# Altium schematic sheet MCU_144_IOs.SchDoc: MCU 144 I/Os
size Tabloid; Date: Not used; ApprovedBy: Not used; CheckedBy: Not used; Author: Not used; CompanyName: STMicroelectronics; DrawnBy: Not used; Engineer: Not used; Organization: Not used; Address1: Not used; Address2: Not used; Address3: Not used; Address4: Not used; DocumentNumber: 3; Revision: Not used; SheetNumber: 3; SheetTotal: 9; CurrentTime: Not used; CurrentDate: Not used; Time: Not used; DocumentFullPathAndName: Not used; DocumentName: Not used; ModifiedDate: Not used; ImagePath: Not used; ProjectName: Not used; Application_BuildNumber: Not used
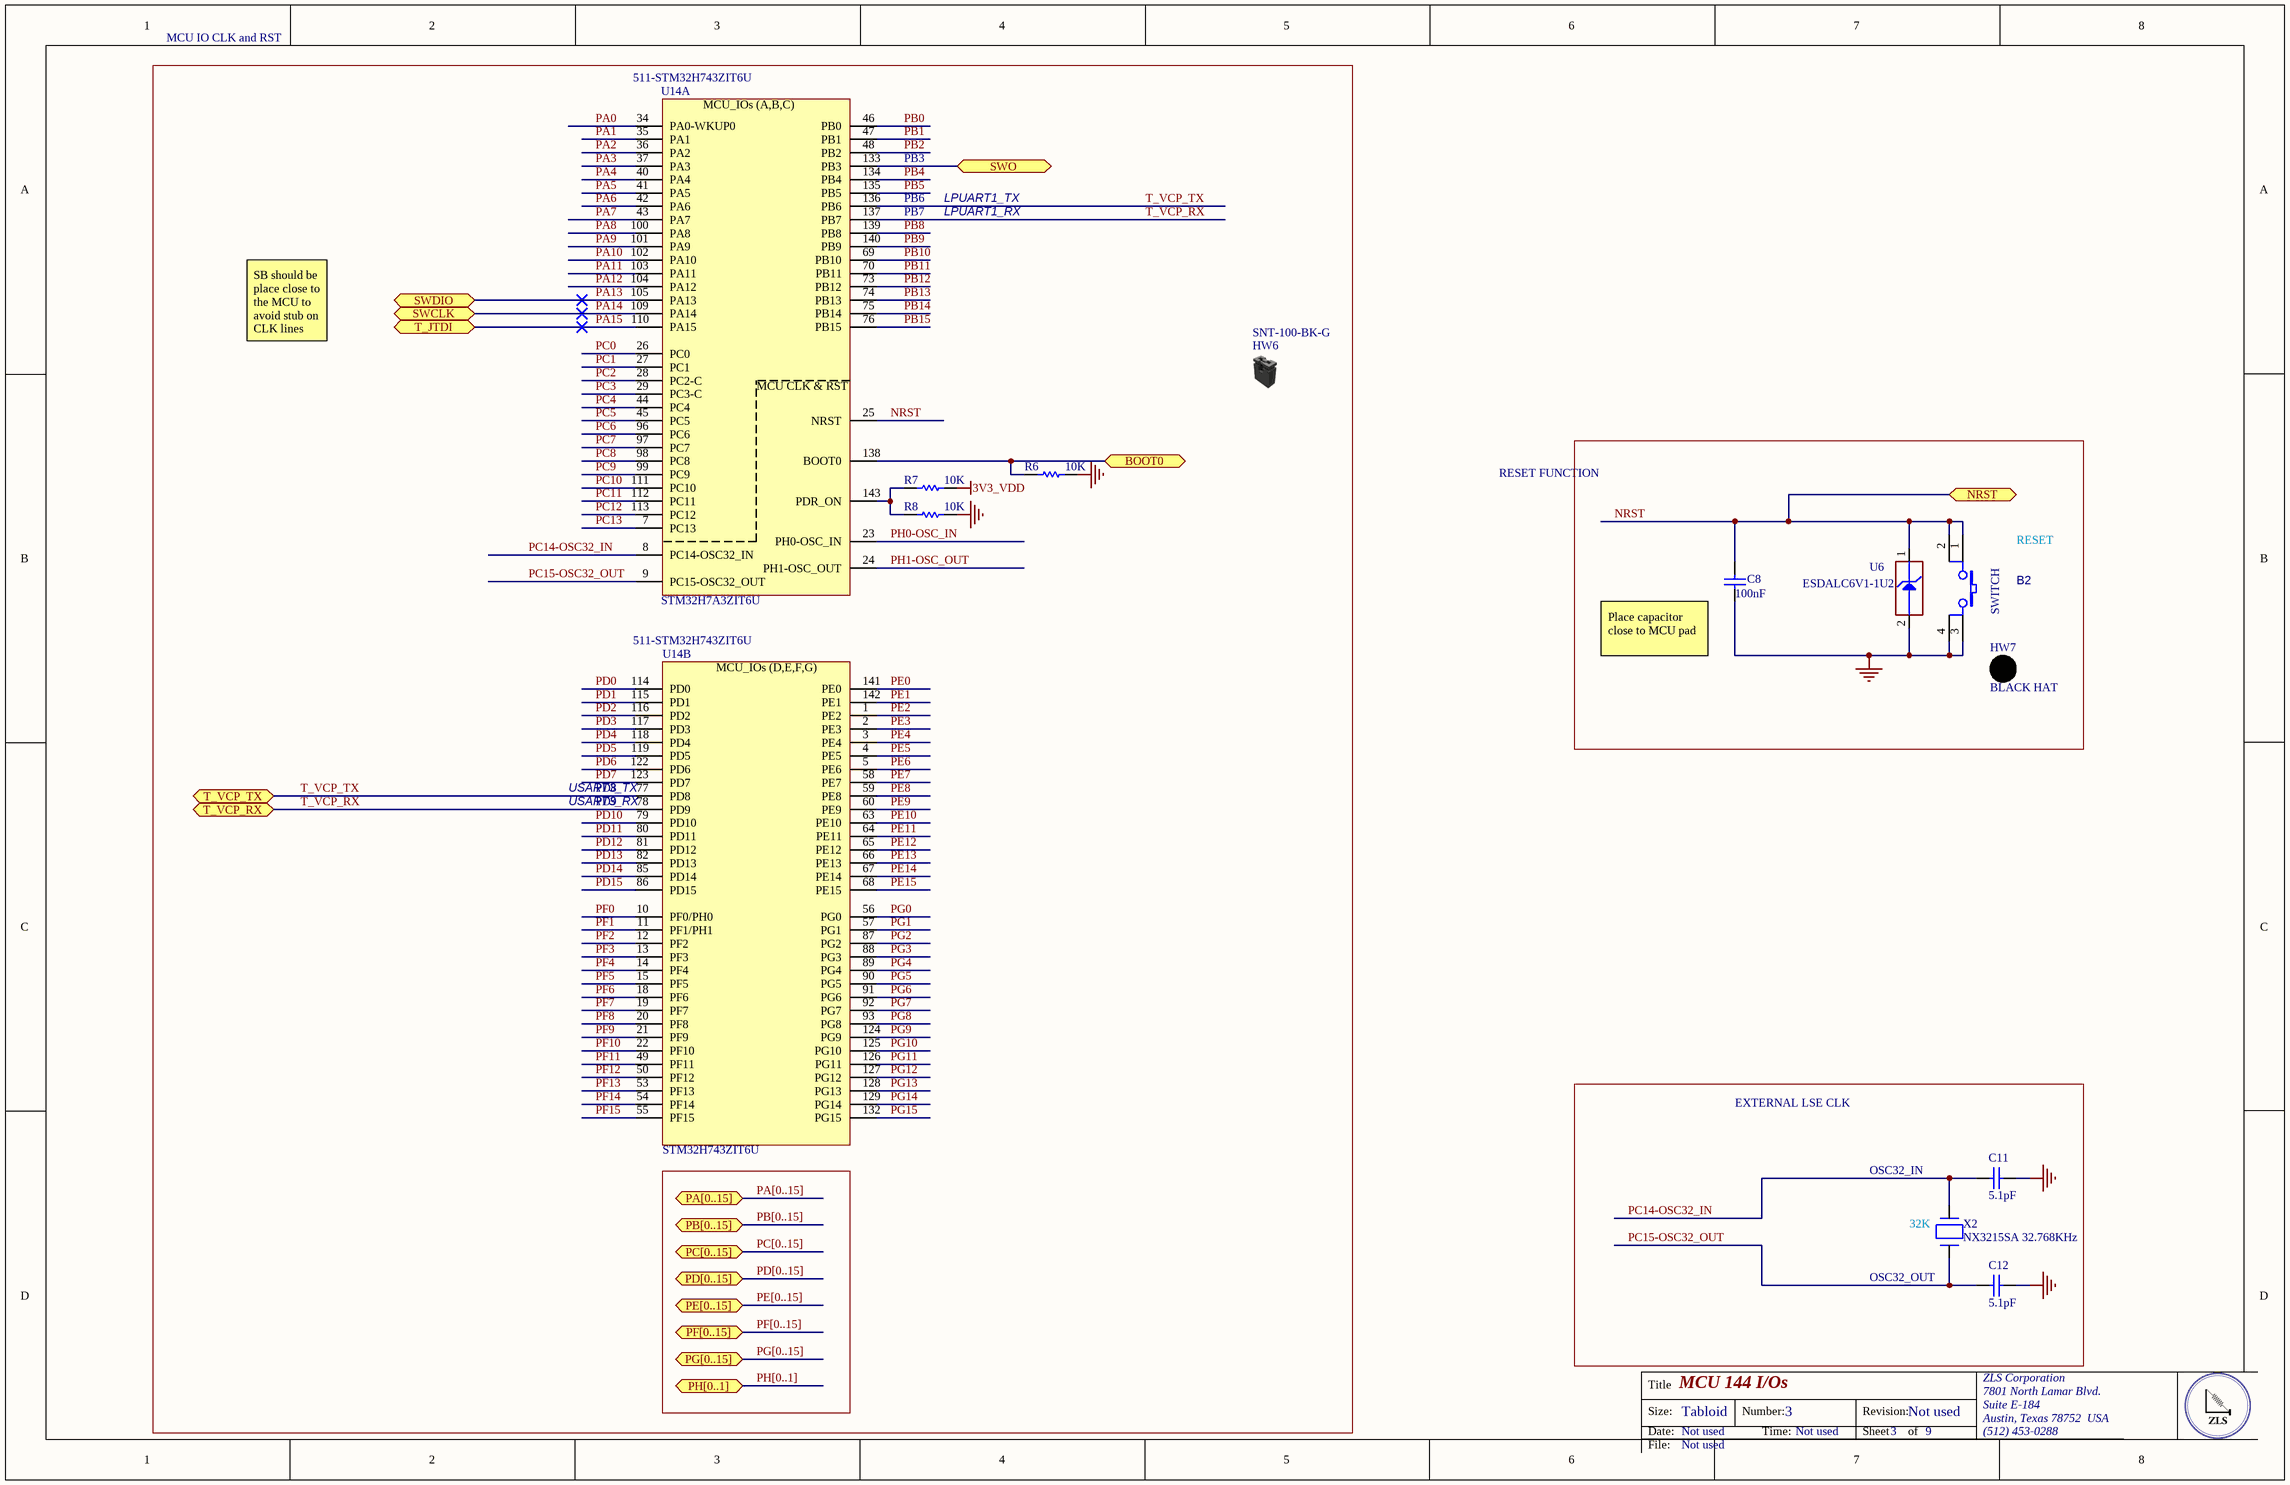
[diagram p0: MCU_144_IOs.SchDoc]

## Parts
B2  value SWITCH  [SWI_WEALTHMETAL_TD-0341_4P_BLACK]  (hidden comment: SW-PUSH-CMS)
C8  Capacitance: 100nF  [C0402]  (hidden comment: Capacitor)
C11  value 5.1pF  [C0402]  (hidden comment: Do Not Place)
C12  value 5.1pF  [C0402]  (hidden comment: Do Not Place)
HW6  value SNT-100-BK-G  (hidden comment: Shunt Black 2.54mm)  (mechanical)
HW7  value BLACK HAT  (hidden comment: BUTTON_HAT_BLACK)  (mechanical)
R6  value 10K  [R0603]  (hidden comment: Resistor)
R7  value 10K  [R0603]  (hidden comment: Resistor)
R8  value 10K  [R0603]  (hidden comment: Resistor)
U6  value ESDALC6V1-1U2  [ESD_ST0201]  (hidden comment: ESD-TRANSIL)
U14  value STM32H7A3ZIT6U  Supplier Part Number 1: 511-STM32H743ZIT6U  [ICC_LQFP144_20X20_P050_SOCKET_YAMAICHI_IC149-144-145-B5_NM]  (hidden comment: STM32H7A3ZIT6)  (parts A,B of 3)
X2  value NX3215SA 32.768KHz  [CRY_NX3215SA_2P]  (hidden comment: XTAL_2_PINS)

## Ports
BOOT0 (bidir), NRST (bidir), PA[0..15] (bidir), PB[0..15] (bidir), PC[0..15] (bidir), PD[0..15] (bidir), PE[0..15] (bidir), PF[0..15] (bidir), PG[0..15] (bidir), PH[0..1] (bidir), SWCLK (bidir), SWDIO (bidir), SWO (bidir), T_JTDI (bidir), T_VCP_RX (bidir), T_VCP_TX (bidir)

## Nets
3V3_VDD: R7.2
GND: B2.3 B2.4 C8.1 C11.2 C12.2 R6.2 R8.2 U6.2(GND)
BOOT0: R6.1 U14.138(BOOT0) ; port BOOT0
NRST: B2.1 B2.2 C8.2 U6.1(IO1) U14.25(NRST) ; port NRST
PA0: U14.34(PA0-WKUP0)
PA1: U14.35(PA1)
PA2: U14.36(PA2)
PA3: U14.37(PA3)
PA4: U14.40(PA4)
PA5: U14.41(PA5)
PA6: U14.42(PA6)
PA7: U14.43(PA7)
PA8: U14.100(PA8)
PA9: U14.101(PA9)
PA10: U14.102(PA10)
PA11: U14.103(PA11)
PA12: U14.104(PA12)
PA13: U14.105(PA13) ; port SWDIO
PA14: U14.109(PA14) ; port SWCLK
PA15: U14.110(PA15) ; port T_JTDI
PB0: U14.46(PB0)
PB1: U14.47(PB1)
PB2: U14.48(PB2)
PB4: U14.134(PB4)
PB5: U14.135(PB5)
PB8: U14.139(PB8)
PB9: U14.140(PB9)
PB10: U14.69(PB10)
PB11: U14.70(PB11)
PB12: U14.73(PB12)
PB13: U14.74(PB13)
PB14: U14.75(PB14)
PB15: U14.76(PB15)
PC0: U14.26(PC0)
PC1: U14.27(PC1)
PC2: U14.28(PC2-C)
PC3: U14.29(PC3-C)
PC4: U14.44(PC4)
PC5: U14.45(PC5)
PC6: U14.96(PC6)
PC7: U14.97(PC7)
PC8: U14.98(PC8)
PC9: U14.99(PC9)
PC10: U14.111(PC10)
PC11: U14.112(PC11)
PC12: U14.113(PC12)
PC13: U14.7(PC13)
PC14-OSC32_IN: C11.1 U14.8(PC14-OSC32_IN) X2.2(X2)
PC15-OSC32_OUT: C12.1 U14.9(PC15-OSC32_OUT) X2.1(X1)
PD0: U14.114(PD0)
PD1: U14.115(PD1)
PD2: U14.116(PD2)
PD3: U14.117(PD3)
PD4: U14.118(PD4)
PD5: U14.119(PD5)
PD6: U14.122(PD6)
PD7: U14.123(PD7)
PD10: U14.79(PD10)
PD11: U14.80(PD11)
PD12: U14.81(PD12)
PD13: U14.82(PD13)
PD14: U14.85(PD14)
PD15: U14.86(PD15)
PE0: U14.141(PE0)
PE1: U14.142(PE1)
PE2: U14.1(PE2)
PE3: U14.2(PE3)
PE4: U14.3(PE4)
PE5: U14.4(PE5)
PE6: U14.5(PE6)
PE7: U14.58(PE7)
PE8: U14.59(PE8)
PE9: U14.60(PE9)
PE10: U14.63(PE10)
PE11: U14.64(PE11)
PE12: U14.65(PE12)
PE13: U14.66(PE13)
PE14: U14.67(PE14)
PE15: U14.68(PE15)
PF0: U14.10(PF0/PH0)
PF1: U14.11(PF1/PH1)
PF2: U14.12(PF2)
PF3: U14.13(PF3)
PF4: U14.14(PF4)
PF5: U14.15(PF5)
PF6: U14.18(PF6)
PF7: U14.19(PF7)
PF8: U14.20(PF8)
PF9: U14.21(PF9)
PF10: U14.22(PF10)
PF11: U14.49(PF11)
PF12: U14.50(PF12)
PF13: U14.53(PF13)
PF14: U14.54(PF14)
PF15: U14.55(PF15)
PG0: U14.56(PG0)
PG1: U14.57(PG1)
PG2: U14.87(PG2)
PG3: U14.88(PG3)
PG4: U14.89(PG4)
PG5: U14.90(PG5)
PG6: U14.91(PG6)
PG7: U14.92(PG7)
PG8: U14.93(PG8)
PG9: U14.124(PG9)
PG10: U14.125(PG10)
PG11: U14.126(PG11)
PG12: U14.127(PG12)
PG13: U14.128(PG13)
PG14: U14.129(PG14)
PG15: U14.132(PG15)
PH0-OSC_IN: U14.23(PH0-OSC_IN)
PH1-OSC_OUT: U14.24(PH1-OSC_OUT)
SWO: U14.133(PB3) ; port SWO
T_VCP_RX: U14.78(PD9) U14.137(PB7) ; port T_VCP_RX
T_VCP_TX: U14.77(PD8) U14.136(PB6) ; port T_VCP_TX
NetR7_1: R7.1 R8.1 U14.143(PDR_ON)

## Buses and harness runs
bus PA[0..15] = port PA[0..15]
bus PB[0..15] = port PB[0..15]
bus PC[0..15] = port PC[0..15]
bus PD[0..15] = port PD[0..15]
bus PE[0..15] = port PE[0..15]
bus PF[0..15] = port PF[0..15]
bus PG[0..15] = port PG[0..15]
bus PH[0..1] = port PH[0..1]

## Notes on the sheet
- MCU IO CLK and RST
- PB3
- PB6
- PB7
- LPUART1_TX
- LPUART1_RX
- SB should be place close to the MCU to avoid stub on CLK lines
- RESET FUNCTION
- RESET
- (near C8) Place capacitor close to MCU pad
- USART3_TX
- USART3_RX
- (near U14) PD8
- (near U14) PD9
- EXTERNAL LSE CLK
- OSC32_IN
- (near X2) 32K
- (near X2) OSC32_OUT
- Title
- Size:
- Date:
- Tabloid
- Number:
- Time:
- Revision:
- Sheet
- of
- ZLS Corporation
- 7801 North Lamar Blvd.
- Suite E-184
- Austin, Texas 78752  USA
- (512) 453-0288
- File:
- (in symbol MCD-01349, part A) MCU_IOs (A,B,C); MCU CLK & RST
- (in symbol MCD-01349, part B) MCU_IOs (D,E,F,G)

## Library data of the parts
B2 = MCD-00001: Non-Open Push-Button 0.1A 24V BLACK; Manufacturer_Part_Number: TD-0341; Manufacturer: WEALTHMETAL; Part_Type: Misc; Provided_By: SUBCO; Internal_Part_Number: MCD-00001; ComponentLink1Description: Datasheet; Status: Released; ComponentLink1URL: http://tunmcdsvn.tun.st.com/Component_Datasheet_Library/Trunk/Misc/Wealthmetal_Tact-Switch_TD0341; ECCN_US: n/a; ECCN_EU: n/a
C8 = MCD-01123: CAP CER 0.1UF 16V X7R 0402; Manufacturer: Yageo; Manufacturer Part Number: CC0402KRX7R7BB104; Tolerance: 10%; Supplier 1: Mouser; Supplier Part Number 1: 603-CC402KRX7R7BB104; Stock 1: 164534511; Pricing 1: 1=0.10000, 10=0.02700, 50=0.02700, 100=0.01200, 1000=0.00700, 2500=0.00600, 10000=0.00500, 20000=0.00400 (USD); RoHS: Yes; Mount: Surface Mount; Case/Package: 0402; Number of Pins: 2; Case Code (Metric): 1005; Case Code (Imperial): 0402; Min Operating Temperature: -55°C; Max Operating Temperature: 125°C; Dielectric: X7R; Voltage Rating: 16V; Voltage Rating (DC): 16V; Packaging: Tape and Reel; Package Quantity: 1; Termination: SMD/SMT; Composition: Ceramic; Voltage: 16V; Length: 1mm; Height: 0.5mm; Width: 0.02inch; Thickness: 0.022inch; Depth: 0.5mm; Radiation Hardening: No; REACH SVHC: No SVHC; Lead Free: Lead Free; Halogen Free: Halogen Free; ComponentLink1URL: https://datasheet.ciiva.com/11788/0900766b80ce67ed-11788364.pdf?src-supplier=RSComponents; ComponentLink1Description: https://datasheet.ciiva.com/11788/0900766b80ce67ed-11788364.pdf?src-supplier=RSComponents; ComponentLink2URL: https://datasheet.ciiva.com/16625/upy-gphc-x7r-6-3v-to-50v-8-16625511.pdf?src-supplier=Avnet+Europe; ComponentLink2Description: https://datasheet.ciiva.com/16625/upy-gphc-x7r-6-3v-to-50v-8-16625511.pdf?src-supplier=Avnet+Europe; ComponentLink3URL: https://datasheet.ciiva.com/161/mlccorderingcode-161544.pdf?src-supplier=Digi-Key; ComponentLink3Description: https://datasheet.ciiva.com/161/mlccorderingcode-161544.pdf?src-supplier=Digi-Key; ComponentLink4URL: https://datasheet.ciiva.com/11587/upy-gphc-x7r-6-3v-to-50v-8-11587305.pdf?src-supplier=Avnet; ComponentLink4Description: https://datasheet.ciiva.com/11587/upy-gphc-x7r-6-3v-to-50v-8-11587305.pdf?src-supplier=Avnet; ComponentLink5URL: https://datasheet.ciiva.com/161/mlccorderingcode-161546.pdf?src-supplier=Digi-Key; ComponentLink5Description: https://datasheet.ciiva.com/161/mlccorderingcode-161546.pdf?src-supplier=Digi-Key; ComponentLink6URL: https://datasheet.ciiva.com/7978/1489800-7978111.pdf?src-supplier=Element14; ComponentLink6Description: https://datasheet.ciiva.com/7978/1489800-7978111.pdf?src-supplier=Element14; ComponentLink7URL: https://datasheet.ciiva.com/161/mlccorderingcode-161545.pdf?src-supplier=Digi-Key; ComponentLink7Description: https://datasheet.ciiva.com/161/mlccorderingcode-161545.pdf?src-supplier=Digi-Key; ComponentLink8URL: https://datasheet.ciiva.com/13395/upy-gphc-x7r-6-3v-to-50v-8-13395676.pdf?src-supplier=Mouser; ComponentLink8Description: https://datasheet.ciiva.com/13395/upy-gphc-x7r-6-3v-to-50v-8-13395676.pdf?src-supplier=Mouser; ComponentLink9URL: https://datasheet.ciiva.com/8033/1734573-8033661.pdf?src-supplier=Element14; ComponentLink9Description: https://datasheet.ciiva.com/8033/1734573-8033661.pdf?src-supplier=Element14; ComponentLink10URL: https://datasheet.ciiva.com/8033/1734573-8033663.pdf?src-supplier=Element14; ComponentLink10Description: https://datasheet.ciiva.com/8033/1734573-8033663.pdf?src-supplier=Element14; ComponentLink11URL: https://datasheet.ciiva.com/28450/1489800-28450335.pdf?src-supplier=Element14; ComponentLink11Description: https://datasheet.ciiva.com/28450/1489800-28450335.pdf?src-supplier=Element14
C11 C12 = MCD-00003: Capacitor, MLCC, 5.1pF, 50V, NPO, +-0.25pF, 0402, T=0.5mm; Manufacturer_Part_Number: CC0402CRNPO9BN5R1; Manufacturer: YAGEO; Provided_By: SUBCO; ECCN_US: EAR99; ECCN_EU: NEC; Internal_Part_Number: MCD-00003; ComponentLink1Description: Datasheet; Status: Released; Part_Type: Capacitor; Package: C0402; ComponentLink1URL: http://tunmcdsvn.tun.st.com/Component_Datasheet_Library/Trunk/Capacitors/Yageo_Capacitor_NP0_16V-to-50V
HW6 = MCD-00043: SHUNT 2.54mm BLACK; Manufacturer: SAMTEC; Part_Type: Mechanical; Alternate_Manufacturer_Part_Number: 316102S111A; Alternate_Manufacturer: JIUBABA; Provided_By: SUBCO; Internal_Part_Number: MCD-00043; Manufacturer_Part_Number: SNT-100-BK-G; ComponentLink1Description: Datasheet; Status: Released; ComponentLink1URL: http://tunmcdsvn.tun.st.com/Component_Datasheet_Library/Trunk/Connectors/Samtec_Shunt_Jumper_SNT100; ECCN_US: n/a; ECCN_EU: n/a
HW7 = MCD-00635: Black Hat for switch TD0341X-G01-BLA; Part_Type: Mechanical; Manufacturer_Part_Number: 988.16.09.3.00003_SH-517; Manufacturer: JIUBABA; Provided_By: SUBCO; Internal_Part_Number: MCD-00635; Status: Released; ComponentLink1Description: Datasheet; ComponentLink1URL: http://tunmcdsvn.tun.st.com/Component_Datasheet_Library/Trunk/Mechanical/Jiubaba_HAT_SH-517; ECCN_US: n/a; ECCN_EU: n/a
R6-R8 = MCD-00220: Resistor,10K,0603,1%,1/10W; Manufacturer_Part_Number: RC0603FR-0710KL; Manufacturer: YAGEO; Provided_By: SUBCO; ECCN_US: EAR99; ECCN_EU: NEC; Internal_Part_Number: MCD-00220; Status: Released; Part_Type: Resistor; ComponentLink1Description: Datasheet; Package: R0603; ComponentLink1URL: http://tunmcdsvn.tun.st.com/Component_Datasheet_Library/Trunk/Resistors/Yageo_Resistor_RC0603-series
U6 = MCD-00170: ESD protection 6V1; Part_Type: Diode; Manufacturer: STMICROELECTRONICS; BMS_Part_Number: 9151132; Provided_By: SUBCO with ST control; ECCN_US: EAR99; ECCN_EU: NEC; Internal_Part_Number: MCD-00170; Status: Released; Manufacturer_Part_Number: ESDALC6V1-1U2; ComponentLink1Description: Datasheet; ComponentLink1URL: http://tunmcdsvn.tun.st.com/Component_Datasheet_Library/Trunk/Diodes/STM_ESD_ESDALC6V1-1U2
U14 = MCD-01349: STM32H7A3ZIT6U, LQFP144 package, 20x20; Part_Type: IC; Manufacturer: STMICROELECTRONICS; BMS_Part_Number: 9175347; Manufacturer Part Number: STM32H743ZIT6U; Provided_By: SUBCO with ST control; ECCN_US: 3A991A2; ECCN_EU: NEC; Internal_Part_Number: MCD-01349; Status: Released; Manufacturer_Part_Number: STM32H7A3ZIT6U; Package: LQFP144; ComponentLink1Description: Datasheet; ComponentLink1URL: http://tunmcdsvn.tun.st.com/Component_Datasheet_Library/Trunk/IC/STM_STM32L552ZET6QU; Supplier 1: Mouser; Stock 1: 24; Pricing 1: 1=13.41000, 10=12.33000, 25=11.82000, 50=11.82000, 100=10.41000, 250=9.90000, 500=9.26000, 1000=8.50000, 2500=7.68000, 10000=9.26000 (USD); RoHS: No
X2 = MCD-00091: Crystal 32.768kHz, 6pF, +-20ppm, 50Kohms max, SMD; Manufacturer_Part_Number: NX3215SA 32.768KHz EXS00A-MU00525; Manufacturer: NDK; Part_Type: Crystal_Osc; BMS_Part_Number: 9157034; Provided_By: SUBCO; ECCN_US: EAR99; ECCN_EU: NEC; Internal_Part_Number: MCD-00091; ComponentLink1Description: Datasheet; Status: Released; ComponentLink1URL: http://tunmcdsvn.tun.st.com/Component_Datasheet_Library/Trunk/Crystal_Osc/NDK_Crystal-For-ST_NX3215SA 32.768KHz EXS00A-MU00525 (EXS10B-21238); Order_Code_Digikey: 644-1386